# Altium schematic sheet sfp_wrapper.SchDoc: SFP module wrapper
size 297 x 209 mm; DrawnBy: TW
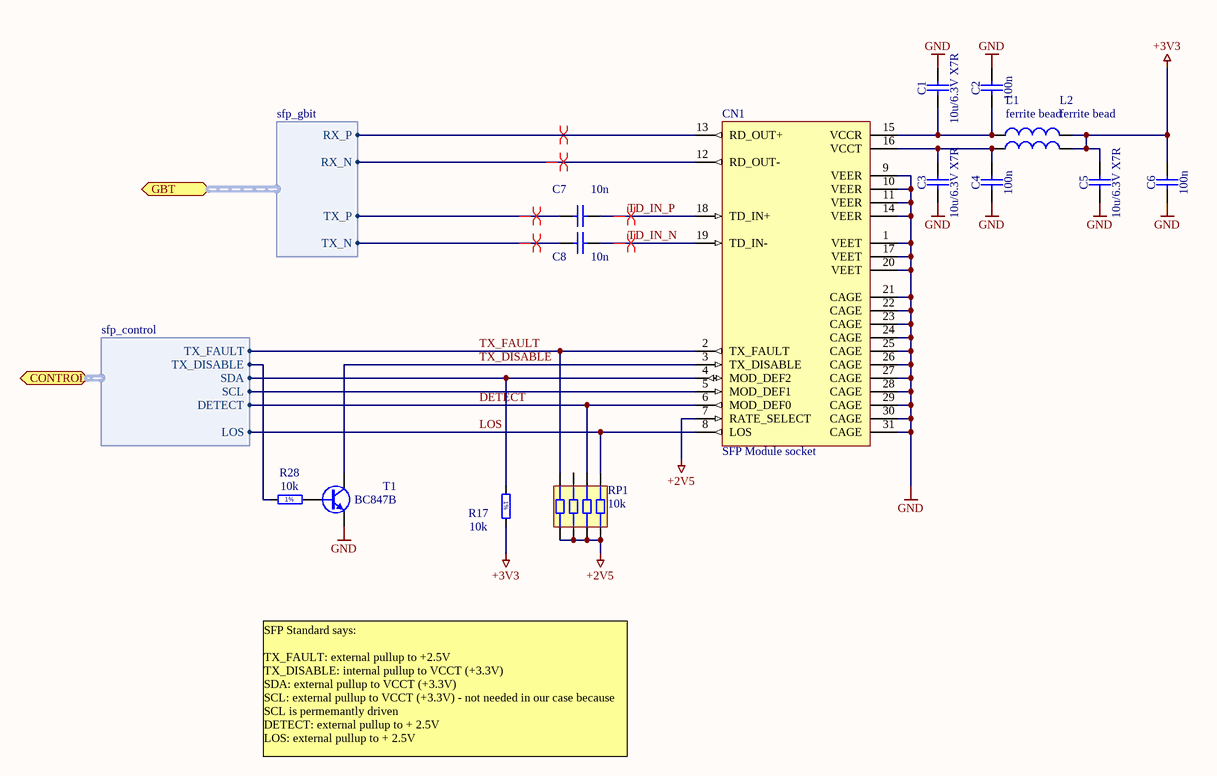
[diagram p0: sfp_wrapper.SchDoc]

## Parts
C1  10u/6.3V X7R  [CAPC3216X140N]
C2  100n  [CAPC1608X87N]
C3  10u/6.3V X7R  [CAPC3216X140N]
C4  100n  [CAPC1608X87N]
C5  10u/6.3V X7R  [CAPC3216X140N]
C6  100n  [CAPC1608X87N]
C7  10n  [CAPC1608X87N]
C8  10n  [CAPC1608X87N]
CN1  SFP Module socket  [SFP_SINGLE_PORT]
L1  value ferrite bead  [INDC2012-0805]  (hidden comment: Inductor)
L2  value ferrite bead  [INDC2012-0805]  (hidden comment: Inductor)
R17  10k  [RESC1608X55N]
R28  10k  [RESC1608X55N]
RP1  10k  [CAY-16]
T1  BC847B  [SOT95P230X110-3N]

## Ports
CONTROL (harness sfp_control), GBT (harness sfp_gbit)

## Harnesses
sfp_gbit: RX_N, RX_P, TX_N, TX_P
sfp_control: DETECT, LOS, SCL, SDA, TX_DISABLE, TX_FAULT

## Nets
+2V5: CN1.7(RATE_SELECT) RP1.1 RP1.2 RP1.3 RP1.4
+3V3: C5.2 C6.2 L1.2 L2.2 R17.2
GND: C1.2 C2.2 C3.1 C4.1 C5.1 C6.1 CN1.1(VEET) CN1.9(VEER) CN1.10(VEER) CN1.11(VEER) CN1.14(VEER) CN1.17(VEET) CN1.20(VEET) CN1.21(CAGE) CN1.22(CAGE) CN1.23(CAGE) CN1.24(CAGE) CN1.25(CAGE) CN1.26(CAGE) CN1.27(CAGE) CN1.28(CAGE) CN1.29(CAGE) CN1.30(CAGE) CN1.31(CAGE) T1.2(E)
DETECT: CN1.6(MOD_DEF0) RP1.6 ; port CONTROL.DETECT
LOS: CN1.8(LOS) RP1.5 ; port CONTROL.LOS
TD_IN_N: C8.2 CN1.19(TD_IN-)
TD_IN_P: C7.2 CN1.18(TD_IN+)
TX_DISABLE: CN1.3(TX_DISABLE) T1.3(C)
TX_FAULT: CN1.2(TX_FAULT) RP1.8 ; port CONTROL.TX_FAULT
NetC1_1: C1.1 C2.1 CN1.15(VCCR) L2.1
NetC3_2: C3.2 C4.2 CN1.16(VCCT) L1.1
NetC7_1: C7.1 ; port GBT.TX_P
NetC8_1: C8.1 ; port GBT.TX_N
NetCN1_4: CN1.4(MOD_DEF2) R17.1 ; port CONTROL.SDA
NetCN1_5: CN1.5(MOD_DEF1) ; port CONTROL.SCL
NetCN1_12: CN1.12(RD_OUT-) ; port GBT.RX_N
NetCN1_13: CN1.13(RD_OUT+) ; port GBT.RX_P
NetR28_1: R28.1 ; port CONTROL.TX_DISABLE
NetR28_2: R28.2 T1.1(B)

Not connected (* = marked no-connect by the designer): RP1 7

## Layout directives
differential pair: NetC7_1, NetC8_1, NetCN1_12, NetCN1_13, TD_IN_N, TD_IN_P

## Notes on the sheet
- SFP Standard says:
  TX_FAULT: external pullup to +2.5V
  TX_DISABLE: internal pullup to VCCT (+3.3V)
  SDA: external pullup to VCCT (+3.3V)
  SCL: external pullup to VCCT (+3.3V) - not needed in our case because SCL is permemantly driven
  DETECT: external pullup to + 2.5V
  LOS: external pullup to + 2.5V
- Project/Equipment
- Document
- Designer
- Drawn by
- Check.by
- File
- Last Mod.
- Print Date
- Sheet
- Size
- A4
- of
- Rev
- (in symbol R0603_10K_1%_0.1W_100PPM) 1%

## Library data of the parts
C1 C3 C5 = CC1206_10UF_10V_10%_X7R: Non-polarised capacitor; Part Description: SMD Multilayer Chip Ceramic Capacitor; Manufacturer: GENERIC; Manufacturer1 Part Number: C1206C106K8RAC; Manufacturer1 Datasheet: \\cern.ch\dfs\Applications\Altium\Datasheets\CC1206_X7R_KEMET.pdf; Value: 10uF; Voltage: 10V; Tolerance: ±10%; Table: Capacitors SMD; Part Number: CC1206_10UF_10V_10%_X7R; Component Kind: Standard; Component Type: Standard; Designator: Capacitor - non polarized; Library Reference: Capacitor - non polarized; Pin Count: 2; Status: Preferred; TC: X7R; Manufacturer Part Number: CC1206_10uF_10V_10%_X7R; Case: 1206; Mounted: Yes; Socket: No; SMD: Yes; Manufacturer1 Example: KEMET; Manufacturer1 ComponentHeight: 1.8mm; HelpURL: \\cern.ch\dfs\Applications\Altium\Datasheets\CC1206_X7R_KEMET.pdf; Author: CERN DEM JLC; CreateDate: 12/3/2007; LatestRevisionDate: 12/3/2007
C2 C4 C6 = CC0603_100NF_50V_10%_X7R: Non-polarised capacitor; Part Description: SMD Multilayer Chip Ceramic Capacitor; Manufacturer: GENERIC; Manufacturer1 Part Number: 223858615649; Manufacturer1 Datasheet: \\cern.ch\dfs\Applications\Altium\Datasheets\CC0603_X7R_PHYCOMP.pdf; Value: 100nF; Voltage: 50V; TC: X7R; Tolerance: ±10%; Table: Capacitors SMD; Part Number: CC0603_100NF_50V_10%_X7R; Component Kind: Standard; Component Type: Standard; Designator: Capacitor - non polarized; Library Reference: Capacitor - non polarized; Pin Count: 2; Status: Preferred; Manufacturer Part Number: CC0603_100NF_50V_10%_X7R; Case: 0603; Mounted: Yes; Socket: No; SMD: Yes; Manufacturer1 Example: PHYCOMP; Manufacturer1 ComponentHeight: 0.87mm; HelpURL: \\cern.ch\dfs\Applications\Altium\Datasheets\CC0603_X7R_PHYCOMP.pdf; Author: CERN DEM JLC; CreateDate: 12/3/2007; LatestRevisionDate: 12/3/2007
C7 C8 = CC0603_10NF_50V_10%_X7R: Non-polarised capacitor; Part Description: SMD Multilayer Chip Ceramic Capacitor; Manufacturer: GENERIC; Manufacturer1 Part Number: 223858615636; Value: 10nF; Voltage: 50V; TC: X7R; Tolerance: ±10%; Table: Capacitors SMD; Part Number: CC0603_10NF_50V_10%_X7R; Component Kind: Standard; Component Type: Standard; Pin Count: 2; Status: Preferred; Manufacturer Part Number: CC0603_10NF_50V_10%_X7R; Case: 0603; Mounted: Yes; Socket: No; SMD: Yes; Manufacturer1 Example: PHYCOMP; Manufacturer1 ComponentHeight: 0.87mm; HelpURL: \\cern.ch\dfs\Applications\Altium\Datasheets\CC0603_X7R_PHYCOMP.pdf; Author: CERN DEM JLC; CreateDate: 12/3/2007; LatestRevisionDate: 12/3/2007
CN1 = SFP_SOCKET_SINGLE: Socket for SFP module; RefId: Far/1256176
L1 L2 = Inductor: Ferrite bead; Published: 8-Jun-2000; Revision: July-2002: Re-released for DXP Platform.; Publisher: Altium Limited
R17 R28 = R0603_10K_1%_0.1W_100PPM: Resistor - 1%; Part Description: General Purpose Thick Film Chip Resistor; Manufacturer: GENERIC; Manufacturer1 Part Number: NRC06F1002TRF; Power: 0.1W; TC: ±100ppm/°C; Table: Resistors SMD; Part Number: R0603_10K_1%_0.1W_100PPM; Component Kind: Standard; Component Type: Standard; Pin Count: 2; Value: 10k; Status: Preferred; Tolerance: ±1%; Manufacturer Part Number: R0603_10K_1%_0.1W_100PPM; Case: 0603; Mounted: Yes; Socket: No; SMD: Yes; Manufacturer1 Example: NIC COMPONENT; Manufacturer1 ComponentHeight: 0.55mm; HelpURL: \\cern.ch\dfs\Applications\Altium\Datasheets\R0603_NIC_NRC.pdf; Author: CERN DEM JLC; CreateDate: 12/3/2007; LatestRevisionDate: 3/13/2008
RP1 = RES_ARRAY_1206: Resistor network 1206 (4x0402) Maritex RAC4Xxxx
T1 = BC847B: NPN Transistor; Part Description: 45V, 100mA NPN general-purpose transistors; Manufacturer: NXP SEMICONDUCTORS; Table: Transistors; Part Number: BC847B; Component Kind: Standard; Component Type: Standard; Device: BC847B; PackageDescription: SOT23, 3 pin, Pitch 0.95mm - 1.3mm W X 2.9mm L X 1.1mm H, IPC Medium Density; Manufacturer Part Number: BC847B; Pin Count: 3; Case: SOT23-3; Mounted: Yes; Socket: No; SMD: Yes; ComponentHeight: 1.1mm; HelpURL: \\cern.ch\dfs\Applications\Altium\Datasheets\BC847B.pdf; Author: CERN DEM JLC; CreateDate: 6/14/2011; LatestRevisionDate: 6/14/2011